# EAGLE design TemplateMote (EAGLE 6.5.0)
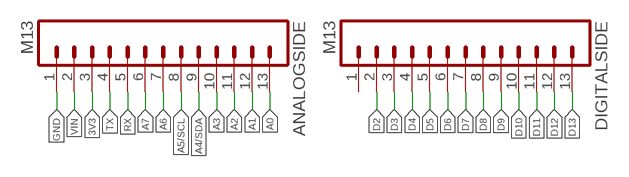
[diagram p0: schematic, sheet 1]

## Parts
ANALOGSIDE  M13  [1X13]
DIGITALSIDE  M13  [1X13]

## Nets
3V3: ANALOGSIDE.3
A0: ANALOGSIDE.13
A1: ANALOGSIDE.12
A2: ANALOGSIDE.11
A3: ANALOGSIDE.10
A4/SDA: ANALOGSIDE.9
A5/SCL: ANALOGSIDE.8
A6: ANALOGSIDE.7
A7: ANALOGSIDE.6
D2: DIGITALSIDE.2
D3: DIGITALSIDE.3
D4: DIGITALSIDE.4
D5: DIGITALSIDE.5
D6: DIGITALSIDE.6
D7: DIGITALSIDE.7
D8: DIGITALSIDE.8
D9: DIGITALSIDE.9
D10: DIGITALSIDE.10
D11: DIGITALSIDE.11
D12: DIGITALSIDE.12
D13: DIGITALSIDE.13
GND: ANALOGSIDE.1
RX: ANALOGSIDE.5
TX: ANALOGSIDE.4
VIN: ANALOGSIDE.2
Unconnected: DIGITALSIDE.1

## Library data of the parts
ANALOGSIDE DIGITALSIDE = SparkFun-Connectors:M13: 13-pin single row .1" header; OC_NEWARK: unknown

## Board
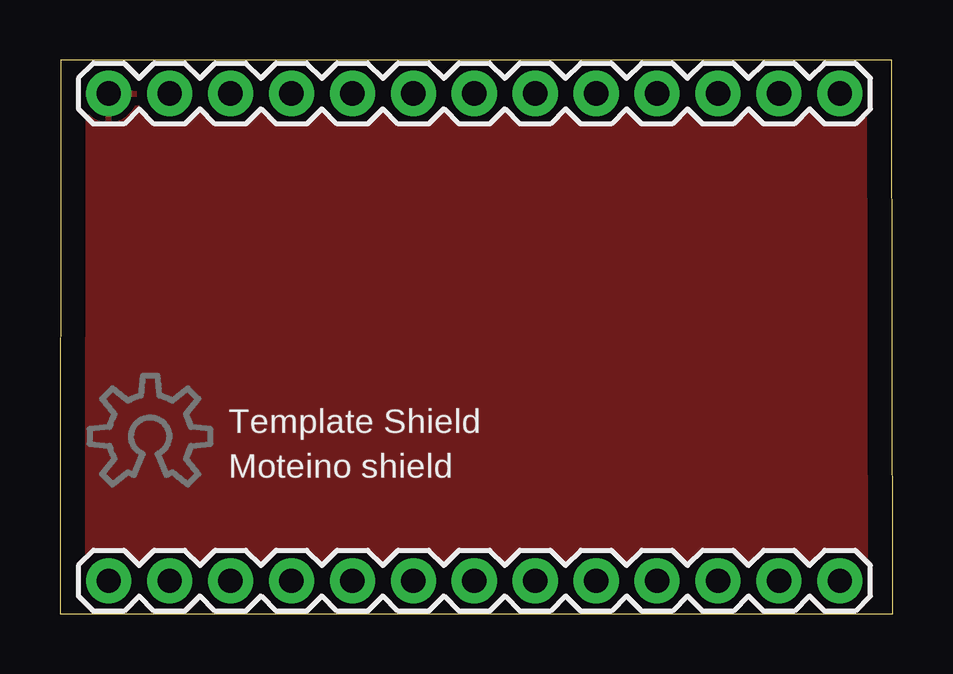
[diagram p1: board, top side]
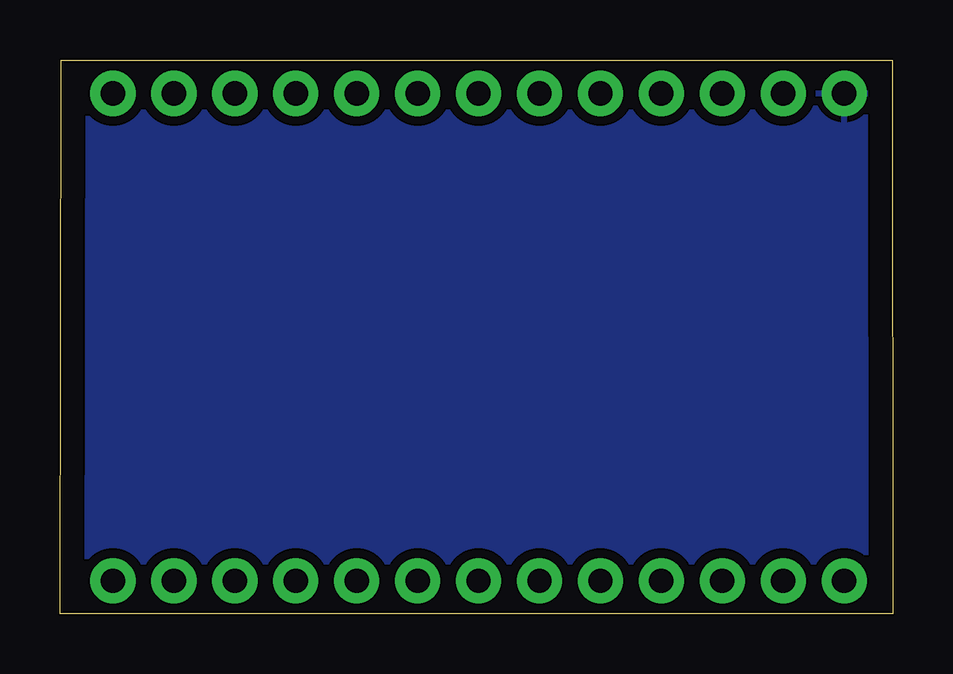
[diagram p2: board, bottom side, seen from below]

Size 34.72 x 23.09 mm. Coordinates in mm from the lower left corner, seen from the top.
Outline: 0,0 34.72,0 34.67,23.09 0.03,23.08 0,0
Copper layers (1*16): Top 0.035mm / dielectric 1.5mm / Bottom 0.035mm
Design rules "default": minimum track width 10mil, minimum drill 24mil, track to track 8mil, track to pad 8mil, pad to pad 8mil, via to via 8mil, smd to smd 8mil, copper to edge 40mil, drill to drill 8mil, minimum pad ring 10mil, minimum via ring 8mil, stop-mask expansion 4mil, vias tented up to drill 0mil, thermal gap 10mil

### Footprints (pad centres in the part's own frame; a part is rotated, then mirrored left to right if it is on the bottom)
1X13 = drill 1.016 pad 1.88: 1 0,0; 2 2.54,0; 3 5.08,0; 4 7.62,0; 5 10.16,0; 6 12.7,0; 7 15.24,0; 8 17.78,0; 9 20.32,0; 10 22.86,0; 11 25.4,0; 12 27.94,0; 13 30.48,0

### Placement (x,y rotation side)
ANALOGSIDE  2.03,21.69 0 top
DIGITALSIDE  2.03,1.37 0 top
E$1  [OSHWLOGO_TOL_0.2]  3.76,7.39 0 top

### Tracks (layer width: path | path; a pad name or v marks a point on that pad's centre or on a via)
GND
  pour Top (isolate 0.406): -1.09,24.75 -0.94,-1.38 36.39,-0.81 36.16,24.03
  pour Bottom (isolate 0.406): -0.64,23.83 -0.53,-0.86 35.62,-0.64 35.31,23.71

### Text on the board
tNames: Template Shield | Moteino shield